# Altium schematic sheet Power_Supply.SchDoc
size A; SheetNumber: 2; SheetTotal: 4
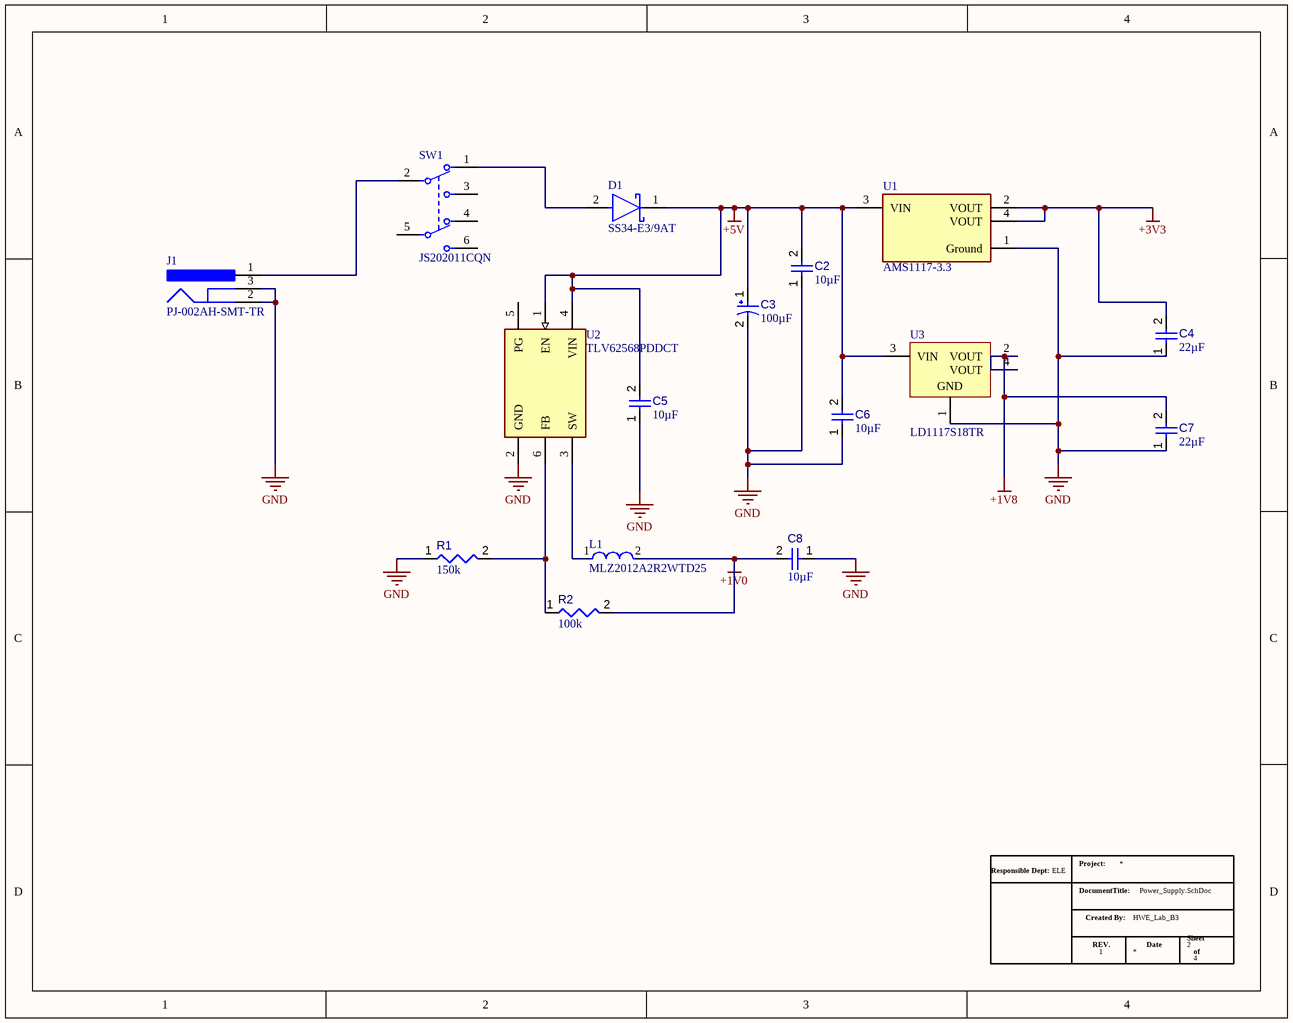
[diagram p0: Power_Supply.SchDoc]

## Parts
*  8Bit_CPU  (value not drawn)  (graphical)
C2  value 10µF  [CAPC0805(2012)145_L]  (hidden comment: Capacitor 10µF +/-20% 25V 0805)
C3  value 100µF  [PNSC-6TPE150MAZB_L]  (hidden comment: Capacitor 6.8µF +/-20% 35V B2)
C4  value 22µF  [CAPC0805(2012)145_L]  (hidden comment: Capacitor 10µF +/-20% 25V 0805)
C5  value 10µF  [CAPC0805(2012)145_L]  (hidden comment: Capacitor 10µF +/-20% 25V 0805)
C6  value 10µF  [CAPC0805(2012)145_L]  (hidden comment: Capacitor 10µF +/-20% 25V 0805)
C7  value 22µF  [CAPC0805(2012)145_L]  (hidden comment: Capacitor 10µF +/-20% 25V 0805)
C8  value 10µF  [CAPC0805(2012)145_L]  (hidden comment: Capacitor 10µF +/-20% 25V 0805)
D1  SS34-E3/9AT  [FP-SMC-MFG]
J1  PJ-002AH-SMT-TR  [CUI-PJ-002AH-4_V]
L1  MLZ2012A2R2WTD25  [FP-MLZ2012-0_85-MFG]
R1  value 150k  [RESC0402(1005)_L]  (hidden comment: Resistor 100K +/-1 % 0402 63 mW)
R2  value 100k  [RESC0402(1005)_L]  (hidden comment: Resistor 100K +/-1 % 0402 63 mW)
SW1  JS202011CQN  [FP-JS202011CQN-MFG]
U1  AMS1117-3.3  [FP-AMS1117-IPC_C]
U2  TLV62568PDDCT  [FP-DDC0006A-MFG]
U3  LD1117S18TR  [SOT-223_M]

## Nets
+1V0: C8.2 L1.2 R2.2
+1V8: C7.2 U3.2(VOUT) U3.4(VOUT)
+3V3: C4.2 U1.2(VOUT) U1.4(VOUT)
+5V: C2.2 C3.1 C5.2 C6.2 D1.1(C) U1.3(VIN) U2.1(EN) U2.4(VIN) U3.3(VIN)
GND: C2.1 C3.2 C4.1 C5.1 C6.1 C7.1 C8.1 J1.2 J1.3 R1.1 U1.1(Ground) U2.2(GND) U3.1(GND)
NetD1_2: D1.2(A) SW1.1
NetJ1_1: J1.1 SW1.2
NetL1_1: L1.1 U2.3(SW)
NetR1_2: R1.2 R2.1 U2.6(FB)

Not connected (* = marked no-connect by the designer): SW1 3 4 5 6; U2 5(PG)

## Notes on the sheet
- (in symbol 8Bit_CPU) Project:; Responsible Dept:; ELE; DocumentTitle:; Created By:; HWE_Lab_B3; Sheet; REV.; Date; 1; of

## Library data of the parts
C2 C4-C8 = CMP-001-00079-4: Chip Capacitor, 10µF +/-20%, 25V, 0805, Thickness 1.45 mm; Tolerance: 10%; Max Operating Temperature: 85°C; Case/Package: 0805; Voltage Rating: 25V; Min Operating Temperature: -55°C; Mounting Technology: SMT; Pins: 2
C3 = CMP-001-00059-3: Molded Tantalum Polymer Capacitor, 6.8 uF, +/- 20%, 35 V, -55 to 105 degC, 2-Pin SMD, RoHS, Tape and Reel; Pins: 2; Voltage Rating: 35V; Case/Package: 1210; Tolerance: 20%; Mounting Technology: SMT; Min Operating Temperature: -55°C; Max Operating Temperature: 105°C
D1 = CMP-02539-000066-1: DIODE SCHOTTKY 40V 3A DO214AB; Peak Non-Repetitive Surge Current: 100A; Forward Voltage: 500mV; Element Configuration: Single; Max Reverse Current: 500uA; Case/Package: SMC; Radiation Hardening: No; Series: -; Max Surge Current: 100A; RoHS Compliant: Yes; Min Operating Temperature: -55°C; Average Rectified Current: 3A; Max Reverse Leakage Current: 500uA; Package Quantity: 3500; Max Reverse Voltage (DC): 40V; Forward Current: 3A; Packaging: Tape and Reel; Max Operating Temperature: 125°C; Max Repetitive Reverse Voltage (Vrrm): 40V; Number of Pins: 2; Mount: Surface Mount
J1 = CMP-2000-06896-2: DC Power Jack, Right Angle, -25 to 85 degC, 4-Pin 14.8 x 9 x 11 mm SMD, RoHS, Tape and Reel; Manufacturer: CUIInc.; Brand: CUI; Inside Contact Diameter: 2mm; Voltage Rating: 24V; Insulation Resistance: 100MOhms; Outside Contact Diameter: 6.5mm; Current Rating: 5A; Mounting Angle: Right; Contact Plating: Nickel; Package Description: 4-Pin Surface Mount Device, Body 14.8 x 9 mm, Pitch 6.1 mm; Factory Pack Quantity: 350; Datasheet Version: Rev. 1.03, 11/2012; Operating Temperature Range: -25Cto+85C; Termination Style: SMD/SMT; Product: Jacks; Contact Gender: Male; Product Category: DCPowerConnectors; RoHS: True; Connector Type: DCPowerJack; Packaging: Reel; Contact Material: Brass; Flammability Rating: UL94V-0; Datasheet URL: http://www.cui.com/product/resource/pj-002ah-smt.pdf; Package Reference: PJ-002AH; Manufacturer URL: http://www.cui.com/; PartNumber: PJ-002AH; Mounting Style: SMD/SMT; Mounting Technology: SurfaceMount; Housing Material: Polyamide(PA)
L1 = CMP-08253-000205-1: Shielded Multilayer Inductor 2.2uH ±20% 650mA 195mΩ AEC-Q200 SMD 0805; Test Frequency: 10MHz; DC Resistance (DCR): 195mR; Core Material: Ferrite; Saturation Current: 210mA; Resistance: 0.26R; Current Rating: 650mA; Case/Package: 0805; Ratings: AEC-Q200; Min Operating Temperature: -55°C; Packaging: Tape and Reel; Width: 1.25mm; RoHS Compliant: Yes; Mount: Surface Mount; Inductance: 2.2uH; Max DC Current: 650mA; Height: 0.85mm; Length: 0.079inch; Weight: 0.000194oz; Height - Seated (Max): 0.041inch; Tolerance: 20%; Package Quantity: 4000; Shielding: Shielded; Case Code (Imperial): 0805; Termination: SMD/SMT; Case Code (Metric): 2012; Max Operating Temperature: 125°C
R1 R2 = CMP-009-00168-3: Chip Resistor, 100 kOhms, +/-1 %, 63 mW, -55 to 155 degC, 0402; Tolerance: 1%; Power: 63mW; Max Operating Temperature: 155°C; Min Operating Temperature: -55°C; Pins: 2; Case/Package: 0402
SW1 = CMP-10038-000022-1: SWITCH SLIDE DPDT 300MA 6V; Contact Resistance: 70mR; Actuator Type: Standard; Actuator Color: Black; Actuator Material: Nylon; Actuator Length: 2mm; Contact Current Rating: 100mA; Electrical Life: 5000Cycles; Illumination Type: Non-Illuminated; Switch Function: On-On; Depth: 3.6mm; Lead Free: Lead Free; Current Rating: 300mA; Throw Configuration: DPDT; REACH SVHC: No SVHC; Flammability Rating: UL94 V-0; Contact Plating: Silver; Max Current Rating: 300mA; Packaging: Bulk; Radiation Hardening: No; Switch Travel: 2mm; Package Quantity: 1; Voltage Rating (DC): 6V; Housing Material: Nylon; Contact Material: Copper Alloy; Min Operating Temperature: -40°C; Max Operating Temperature: 85°C; Termination: PC Pins; Mount: Through Hole; Length: 9mm; Max Voltage Rating (DC): 6V; RoHS Compliant: Yes; Series: JS; Orientation: Vertical
U1 = CMP-209535-000001-1: LDO Voltage Regulators 1A, 3.3V; Manufacturer: Advanced Monolithic Systems; Dropout Voltage: 1.1V; Output Type: Fixed; Nominal Supply Current: 5mA; Max Power Dissipation: 1.2W; Max Supply Voltage: 15V; Number Of Outputs: 1; Standoff Height: 0.64mm; Max Junction Temp: +125°C; Height: 1.8mm; Package: AMS1117; Device Class L2: Power Management ICs; ComponentLink2Description: Datasheet; ComponentLink2URL: http://www.advanced-monolithic.com/pdf/ds1117.pdf; Category: IC; RoHS: TRUE; Automotive: No; Device Class L1: Integrated Circuits (ICs); Output Current: 1A; Device Class L3: Voltage Regulators - Linear; Temperature: -40°C to +125°C; Output Voltage: 3.3V; Manufacturer Part Number: AMS1117-3.3; Temperature Range Low: -40°C; Octopart: https://octopart.com/ams1117-3.3-advanced+monolithic+systems-25899300; Lead Free: Yes; Ipc Land Pattern Name: SOT229P700X180-4; Temperature Range High: +125°C
U2 = CMP-04918-000671-1: IC REG BUCK ADJ 1A TSOT23-6; Min Output Voltage: 600mV; Output Type: Adjustable; Switching Frequency: 1.5MHz; Output Configuration: Positive; Synchronous Rectifier: Yes; Number of Outputs: 1; Max Input Voltage: 5.5V; Min Input Voltage: 2.5V; Max Operating Temperature: 125°C; Packaging: Cut Tape; Min Operating Temperature: -40°C; RoHS Compliant: Yes; Output Current: 1A; Mount: Surface Mount; Case/Package: SOT-23-6; Max Output Voltage: 5.5V
U3 = CMP-0244-00308-1: Fixed Low Drop Positive Voltage Regulator, 1.8V, 4-Pin SOT-223, Tape and Reel; ComponentLink1URL: http://www.st.com; PackageReference: SOT-223; PackageDescription: 4-Pin SOT-223 Package, 6.5 x 3.5 mm Body, 2.3 mm Pitch, 7 mm Lead Span; ComponentLink2URL: http://www.st.com/internet/com/TECHNICAL_RESOURCES/TECHNICAL_LITERATURE/DATASHEET/CD00000544.pdf; ComponentLink2Description: Datasheet; ComponentLink1Description: Manufacturer URL; DatasheetVersion: 1/11/2011; PackageVersion: 2010